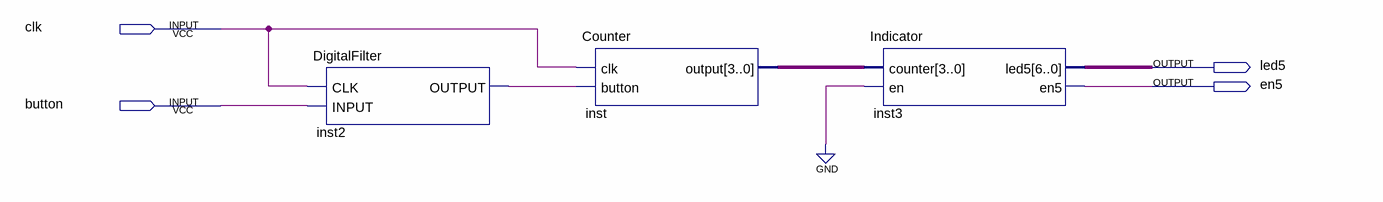
[diagram p0: schematic sheet]
// Quartus schematic Indicator.bdf as structural Verilog: 3 symbols, 4 pins
module Indicator (
  input  clk,
  input  button,
  output led5,
  output en5
);

  wire inst2_output;
  wire [3:0] inst_output;
  wire [6:0] inst3_led5;

  DigitalFilter inst2 (.CLK(clk), .INPUT(button), .OUTPUT(inst2_output));
  Counter inst (.clk(clk), .button(inst2_output), .\output (inst_output));
  Indicator inst3 (.counter(inst_output), .en(1'b0), .led5(inst3_led5), .en5(en5));
endmodule
